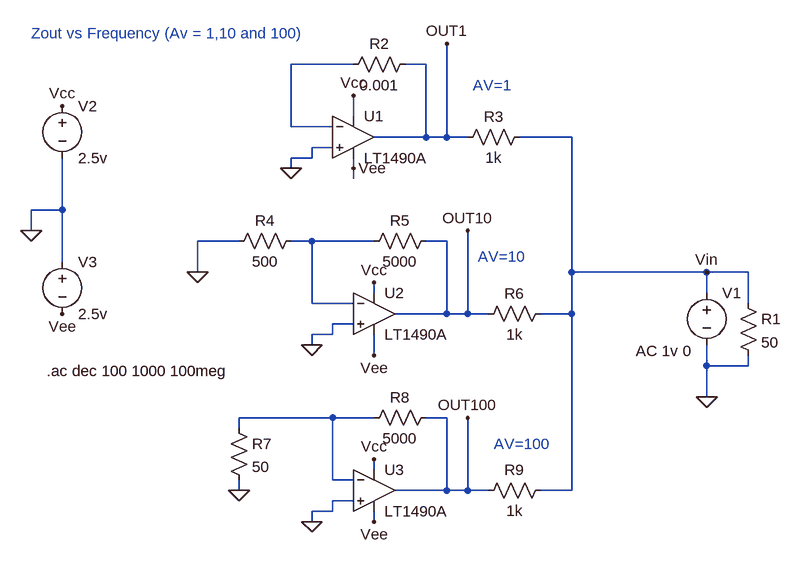
[diagram p0: schematic Zout.asc]
Zout.asc, the LTspice schematic file:
Version 4
SHEET 1 880 700
WIRE 176 -160 80 -160
WIRE 288 -160 256 -160
WIRE 176 -80 176 -112
WIRE 80 -64 80 -160
WIRE 144 -64 80 -64
WIRE 288 -48 288 -160
WIRE 288 -48 208 -48
WIRE 320 -48 320 -192
WIRE 320 -48 288 -48
WIRE 352 -48 320 -48
WIRE 512 -48 432 -48
WIRE 144 -32 112 -32
WIRE 112 -16 112 -32
WIRE 112 -16 80 -16
WIRE 80 0 80 -16
WIRE 176 0 176 -16
WIRE 176 16 176 0
WIRE -272 64 -272 -16
WIRE -272 64 -320 64
WIRE -320 96 -320 64
WIRE 0 112 -64 112
WIRE 112 112 80 112
WIRE 208 112 112 112
WIRE 320 112 288 112
WIRE -272 144 -272 64
WIRE -64 160 -64 112
WIRE 512 160 512 -48
WIRE 720 160 512 160
WIRE 784 160 720 160
WIRE 208 192 208 176
WIRE 720 192 720 160
WIRE 112 208 112 112
WIRE 176 208 112 208
WIRE 784 208 784 160
WIRE 320 224 320 112
WIRE 320 224 240 224
WIRE 352 224 352 96
WIRE 352 224 320 224
WIRE 384 224 352 224
WIRE 512 224 512 160
WIRE 512 224 464 224
WIRE 176 240 144 240
WIRE 144 256 144 240
WIRE 144 256 112 256
WIRE 112 272 112 256
WIRE 208 288 208 256
WIRE 720 304 720 272
WIRE 784 304 784 288
WIRE 784 304 720 304
WIRE 720 352 720 304
WIRE 144 384 0 384
WIRE 208 384 144 384
WIRE 320 384 288 384
WIRE 0 400 0 384
WIRE 208 464 208 448
WIRE 144 480 144 384
WIRE 176 480 144 480
WIRE 0 496 0 480
WIRE 320 496 320 384
WIRE 320 496 240 496
WIRE 352 496 352 384
WIRE 352 496 320 496
WIRE 384 496 352 496
WIRE 512 496 512 224
WIRE 512 496 464 496
WIRE 176 512 144 512
WIRE 144 528 144 512
WIRE 144 528 112 528
WIRE 112 544 112 528
WIRE 208 544 208 528
FLAG -320 96 0
FLAG -272 -96 Vcc
FLAG 176 -112 Vcc
FLAG -272 224 Vee
FLAG 176 0 Vee
FLAG 720 352 0
FLAG 208 176 Vcc
FLAG 208 288 Vee
FLAG 0 496 0
FLAG 208 448 Vcc
FLAG 208 544 Vee
FLAG 112 272 0
FLAG 320 -192 OUT1
FLAG 352 96 OUT10
FLAG 352 384 OUT100
FLAG 80 0 0
FLAG 112 544 0
FLAG -64 160 0
FLAG 720 160 Vin
SYMBOL voltage 720 176 R0
WINDOW 3 -295 281 Left 2
WINDOW 123 -109 105 Left 2
WINDOW 39 0 0 Left 2
SYMATTR Value ""
SYMATTR Value2 AC 1v 0
SYMATTR InstName V1
SYMBOL voltage -272 -112 R0
WINDOW 123 0 0 Left 2
WINDOW 39 0 0 Left 2
SYMATTR InstName V2
SYMATTR Value 2.5v
SYMBOL voltage -272 128 R0
WINDOW 123 0 0 Left 2
WINDOW 39 0 0 Left 2
SYMATTR InstName V3
SYMATTR Value 2.5v
SYMBOL res 272 -176 R90
WINDOW 0 0 56 VBottom 2
WINDOW 3 32 56 VTop 2
SYMATTR InstName R2
SYMATTR Value 0.001
SYMBOL res 448 -64 R90
WINDOW 0 0 56 VBottom 2
WINDOW 3 32 56 VTop 2
SYMATTR InstName R3
SYMATTR Value 1k
SYMBOL res 96 96 R90
WINDOW 0 0 56 VBottom 2
WINDOW 3 32 56 VTop 2
SYMATTR InstName R4
SYMATTR Value 500
SYMBOL res 304 96 R90
WINDOW 0 0 56 VBottom 2
WINDOW 3 32 56 VTop 2
SYMATTR InstName R5
SYMATTR Value 5000
SYMBOL res 480 208 R90
WINDOW 0 0 56 VBottom 2
WINDOW 3 32 56 VTop 2
SYMATTR InstName R6
SYMATTR Value 1k
SYMBOL res -16 384 R0
SYMATTR InstName R7
SYMATTR Value 50
SYMBOL res 304 368 R90
WINDOW 0 0 56 VBottom 2
WINDOW 3 32 56 VTop 2
SYMATTR InstName R8
SYMATTR Value 5000
SYMBOL res 480 480 R90
WINDOW 0 0 56 VBottom 2
WINDOW 3 32 56 VTop 2
SYMATTR InstName R9
SYMATTR Value 1k
SYMBOL res 768 192 R0
SYMATTR InstName R1
SYMATTR Value 50
SYMBOL Opamps\\LT1490A 176 -112 R0
SYMATTR InstName U1
SYMBOL Opamps\\LT1490A 208 160 R0
SYMATTR InstName U2
SYMBOL Opamps\\LT1490A 208 432 R0
SYMATTR InstName U3
TEXT 360 -128 Left 2 ;AV=1
TEXT 368 136 Left 2 ;AV=10
TEXT 392 424 Left 2 ;AV=100
TEXT -296 312 Left 2 !.ac dec 100 1000 100meg
TEXT -320 -208 Left 2 ;Zout vs Frequency (Av = 1,10 and 100)

The netlist it stands for:
* Zout.asc
V1 Vin 0 AC 1v 0
V2 Vcc 0 2.5v
V3 0 Vee 2.5v
R2 OUT1 N001 0.001
R3 Vin OUT1 1k
R4 N002 0 500
R5 OUT10 N002 5000
R6 Vin OUT10 1k
R7 N003 0 50
R8 OUT100 N003 5000
R9 Vin OUT100 1k
R1 Vin 0 50
XU1 0 N001 Vcc Vee OUT1 LT1490A  ; pins In+ In- V+ V- OUT
XU2 0 N002 Vcc Vee OUT10 LT1490A  ; pins In+ In- V+ V- OUT
XU3 0 N003 Vcc Vee OUT100 LT1490A  ; pins In+ In- V+ V- OUT
* AV=1
* AV=10
* AV=100
.ac dec 100 1000 100meg
* Zout vs Frequency (Av = 1,10 and 100)
.backanno
.end